# Altium schematic sheet FPGA.SchDoc: TE0890 - S7Mini
size A4; Organization: Trenz Electronic GmbH; DocumentNumber: TE0890; Revision: 01; SheetNumber: 3; SheetTotal: 6; Date: 2018-08-06; Author: Vitali Tsiukala; CompanyName: Trenz Electronic GmbH; DrawnBy: Vitali Tsiukala; Engineer: Vitali Tsiukala; ProjectName: TE0723 Arduino
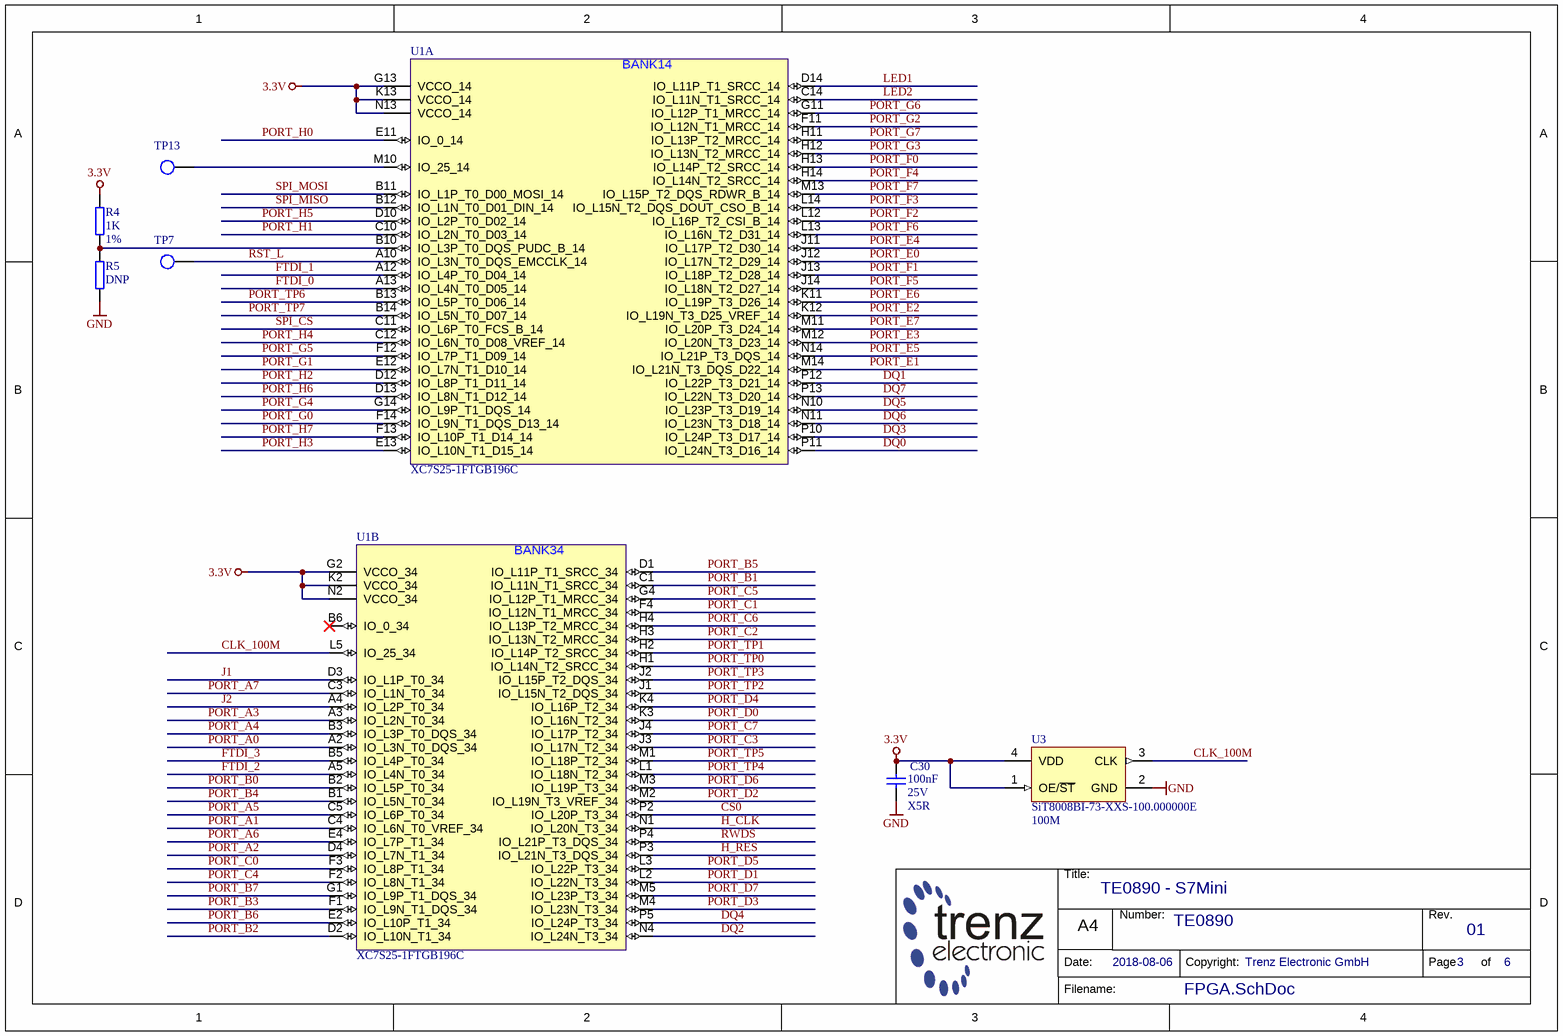
[diagram p0: FPGA.SchDoc]

## Parts
C30  100nF  Voltage: 25V  Technology: X5R  [CAPC1005X55N]
R4  1K  Tolerance: 1%  [RESC1005X40N]
R5  DNP  [RESC1005X40N]  (no BOM)
TP7  Testpoint 0.8mm THT  [TP_0.8mm_THT]  (value not drawn)
TP13  Testpoint 0.8mm THT  [TP_0.8mm_THT]  (value not drawn)
U1  XC7S25-1FTGB196C  [BGA196C100P14X14_1500X1500X155B50N]  (parts A,B of 5)
U3  SiT8008BI-73-XXS-100.000000E  value 100M  [2016]

## Nets
3.3V: C30.1 R4.1 U1.G2(VCCO_34) U1.G13(VCCO_14) U1.K2(VCCO_34) U1.K13(VCCO_14) U1.N2(VCCO_34) U1.N13(VCCO_14) U3.1(OE/~{ST}) U3.4(VDD)
GND: C30.2 R5.2 U3.2(GND)
CLK_100M: U1.L5(IO_25_34) U3.3(CLK)
CS0: U1.P2(IO_L20P_T3_34)
DQ0: U1.P11(IO_L24N_T3_D16_14)
DQ1: U1.P12(IO_L22P_T3_D21_14)
DQ2: U1.N4(IO_L24N_T3_34)
DQ3: U1.P10(IO_L24P_T3_D17_14)
DQ4: U1.P5(IO_L24P_T3_34)
DQ5: U1.N10(IO_L23P_T3_D19_14)
DQ6: U1.N11(IO_L23N_T3_D18_14)
DQ7: U1.P13(IO_L22N_T3_D20_14)
FTDI_0: U1.A13(IO_L4N_T0_D05_14)
FTDI_1: U1.A12(IO_L4P_T0_D04_14)
FTDI_2: U1.A5(IO_L4N_T0_34)
FTDI_3: U1.B5(IO_L4P_T0_34)
H_CLK: U1.N1(IO_L20N_T3_34)
H_RES: U1.P3(IO_L21N_T3_DQS_34)
J1: U1.D3(IO_L1P_T0_34)
J2: U1.A4(IO_L2P_T0_34)
LED1: U1.D14(IO_L11P_T1_SRCC_14)
LED2: U1.C14(IO_L11N_T1_SRCC_14)
PORT_A0: U1.A2(IO_L3N_T0_DQS_34)
PORT_A1: U1.C4(IO_L6N_T0_VREF_34)
PORT_A2: U1.D4(IO_L7N_T1_34)
PORT_A3: U1.A3(IO_L2N_T0_34)
PORT_A4: U1.B3(IO_L3P_T0_DQS_34)
PORT_A5: U1.C5(IO_L6P_T0_34)
PORT_A6: U1.E4(IO_L7P_T1_34)
PORT_A7: U1.C3(IO_L1N_T0_34)
PORT_B0: U1.B2(IO_L5P_T0_34)
PORT_B1: U1.C1(IO_L11N_T1_SRCC_34)
PORT_B2: U1.D2(IO_L10N_T1_34)
PORT_B3: U1.F1(IO_L9N_T1_DQS_34)
PORT_B4: U1.B1(IO_L5N_T0_34)
PORT_B5: U1.D1(IO_L11P_T1_SRCC_34)
PORT_B6: U1.E2(IO_L10P_T1_34)
PORT_B7: U1.G1(IO_L9P_T1_DQS_34)
PORT_C0: U1.F3(IO_L8P_T1_34)
PORT_C1: U1.F4(IO_L12N_T1_MRCC_34)
PORT_C2: U1.H3(IO_L13N_T2_MRCC_34)
PORT_C3: U1.J3(IO_L17N_T2_34)
PORT_C4: U1.F2(IO_L8N_T1_34)
PORT_C5: U1.G4(IO_L12P_T1_MRCC_34)
PORT_C6: U1.H4(IO_L13P_T2_MRCC_34)
PORT_C7: U1.J4(IO_L17P_T2_34)
PORT_D0: U1.K3(IO_L16N_T2_34)
PORT_D1: U1.L2(IO_L22N_T3_34)
PORT_D2: U1.M2(IO_L19N_T3_VREF_34)
PORT_D3: U1.M4(IO_L23N_T3_34)
PORT_D4: U1.K4(IO_L16P_T2_34)
PORT_D5: U1.L3(IO_L22P_T3_34)
PORT_D6: U1.M3(IO_L19P_T3_34)
PORT_D7: U1.M5(IO_L23P_T3_34)
PORT_E0: U1.J12(IO_L17N_T2_D29_14)
PORT_E1: U1.M14(IO_L21N_T3_DQS_D22_14)
PORT_E2: U1.K12(IO_L19N_T3_D25_VREF_14)
PORT_E3: U1.M12(IO_L20N_T3_D23_14)
PORT_E4: U1.J11(IO_L17P_T2_D30_14)
PORT_E5: U1.N14(IO_L21P_T3_DQS_14)
PORT_E6: U1.K11(IO_L19P_T3_D26_14)
PORT_E7: U1.M11(IO_L20P_T3_D24_14)
PORT_F0: U1.H13(IO_L14P_T2_SRCC_14)
PORT_F1: U1.J13(IO_L18P_T2_D28_14)
PORT_F2: U1.L12(IO_L16P_T2_CSI_B_14)
PORT_F3: U1.L14(IO_L15N_T2_DQS_DOUT_CSO_B_14)
PORT_F4: U1.H14(IO_L14N_T2_SRCC_14)
PORT_F5: U1.J14(IO_L18N_T2_D27_14)
PORT_F6: U1.L13(IO_L16N_T2_D31_14)
PORT_F7: U1.M13(IO_L15P_T2_DQS_RDWR_B_14)
PORT_G0: U1.F14(IO_L9N_T1_DQS_D13_14)
PORT_G1: U1.E12(IO_L7N_T1_D10_14)
PORT_G2: U1.F11(IO_L12N_T1_MRCC_14)
PORT_G3: U1.H12(IO_L13N_T2_MRCC_14)
PORT_G4: U1.G14(IO_L9P_T1_DQS_14)
PORT_G5: U1.F12(IO_L7P_T1_D09_14)
PORT_G6: U1.G11(IO_L12P_T1_MRCC_14)
PORT_G7: U1.H11(IO_L13P_T2_MRCC_14)
PORT_H0: U1.E11(IO_0_14)
PORT_H1: U1.C10(IO_L2N_T0_D03_14)
PORT_H2: U1.D12(IO_L8P_T1_D11_14)
PORT_H3: U1.E13(IO_L10N_T1_D15_14)
PORT_H4: U1.C12(IO_L6N_T0_D08_VREF_14)
PORT_H5: U1.D10(IO_L2P_T0_D02_14)
PORT_H6: U1.D13(IO_L8N_T1_D12_14)
PORT_H7: U1.F13(IO_L10P_T1_D14_14)
PORT_TP0: U1.H1(IO_L14N_T2_SRCC_34)
PORT_TP1: U1.H2(IO_L14P_T2_SRCC_34)
PORT_TP2: U1.J1(IO_L15N_T2_DQS_34)
PORT_TP3: U1.J2(IO_L15P_T2_DQS_34)
PORT_TP4: U1.L1(IO_L18N_T2_34)
PORT_TP5: U1.M1(IO_L18P_T2_34)
PORT_TP6: U1.B13(IO_L5P_T0_D06_14)
PORT_TP7: U1.B14(IO_L5N_T0_D07_14)
RST_L: TP7.1 U1.A10(IO_L3N_T0_DQS_EMCCLK_14)
RWDS: U1.P4(IO_L21P_T3_DQS_34)
SPI_CS: U1.C11(IO_L6P_T0_FCS_B_14)
SPI_MISO: U1.B12(IO_L1N_T0_D01_DIN_14)
SPI_MOSI: U1.B11(IO_L1P_T0_D00_MOSI_14)
NetR4_2: R4.2 R5.1 U1.B10(IO_L3P_T0_DQS_PUDC_B_14)
NetTP13_1: TP13.1 U1.M10(IO_25_14)

Not connected (* = marked no-connect by the designer): U1 B6(IO_0_34)*

## Notes on the sheet
- Title:
- Number:
- Rev.
- Date:
- A4
- Copyright:
- Page
- of
- Filename:
- (in symbol 29276, part A) BANK14
- (in symbol 29276, part B) BANK34

## Library data of the parts
C30 = 22472: KON 100nF 25V X5R ±10% SMD BF 1005 (0402); AN: 22472; Mixed: SMT; Value: 100n; Preferred: Yes; Temperature-Range: -55/+85; Case: 1005 (0402)
R4 = 22752: WID SMD 1K 1% 0,063W  BF 1005 (0402); AN: 22752; Mixed: SMT; Preferred: Yes; H-ART: RC0402FR-071KL; Case: 1005 (0402); Technology: TK100; Value: 1K
R5 = 29416: WID SMD BF 1005 (0402) DNP; AN: 29416; Case: 1005 (0402); Value: DNP
TP7 TP13 = 27481: Testpoint 0.8mm TH; AN: 27481
U1 = 29276: AN: 29276; Mixed: SMT; Temperature-Range: 0/+85; Case: FTGB196; HelpURL: B:\AD\adlib\datasheet\XC7; H-ART: XC7S25-1FTGB196C
U3 = 25961: SiT8008BI-73-XXS-100.000000E MEMS Oszillator 100MHz; AN: 25961; Mixed: SMT; Trenz-Stock: Yes; Case: 2.0  x 1.6mm; HelpURL: B:\AD\adlib\datasheet\SiT8008; Preferred: Yes; H-ART: SiT8008BI-73-XXS-100.000000E